# EAGLE design untitled (EAGLE 9.6.2)
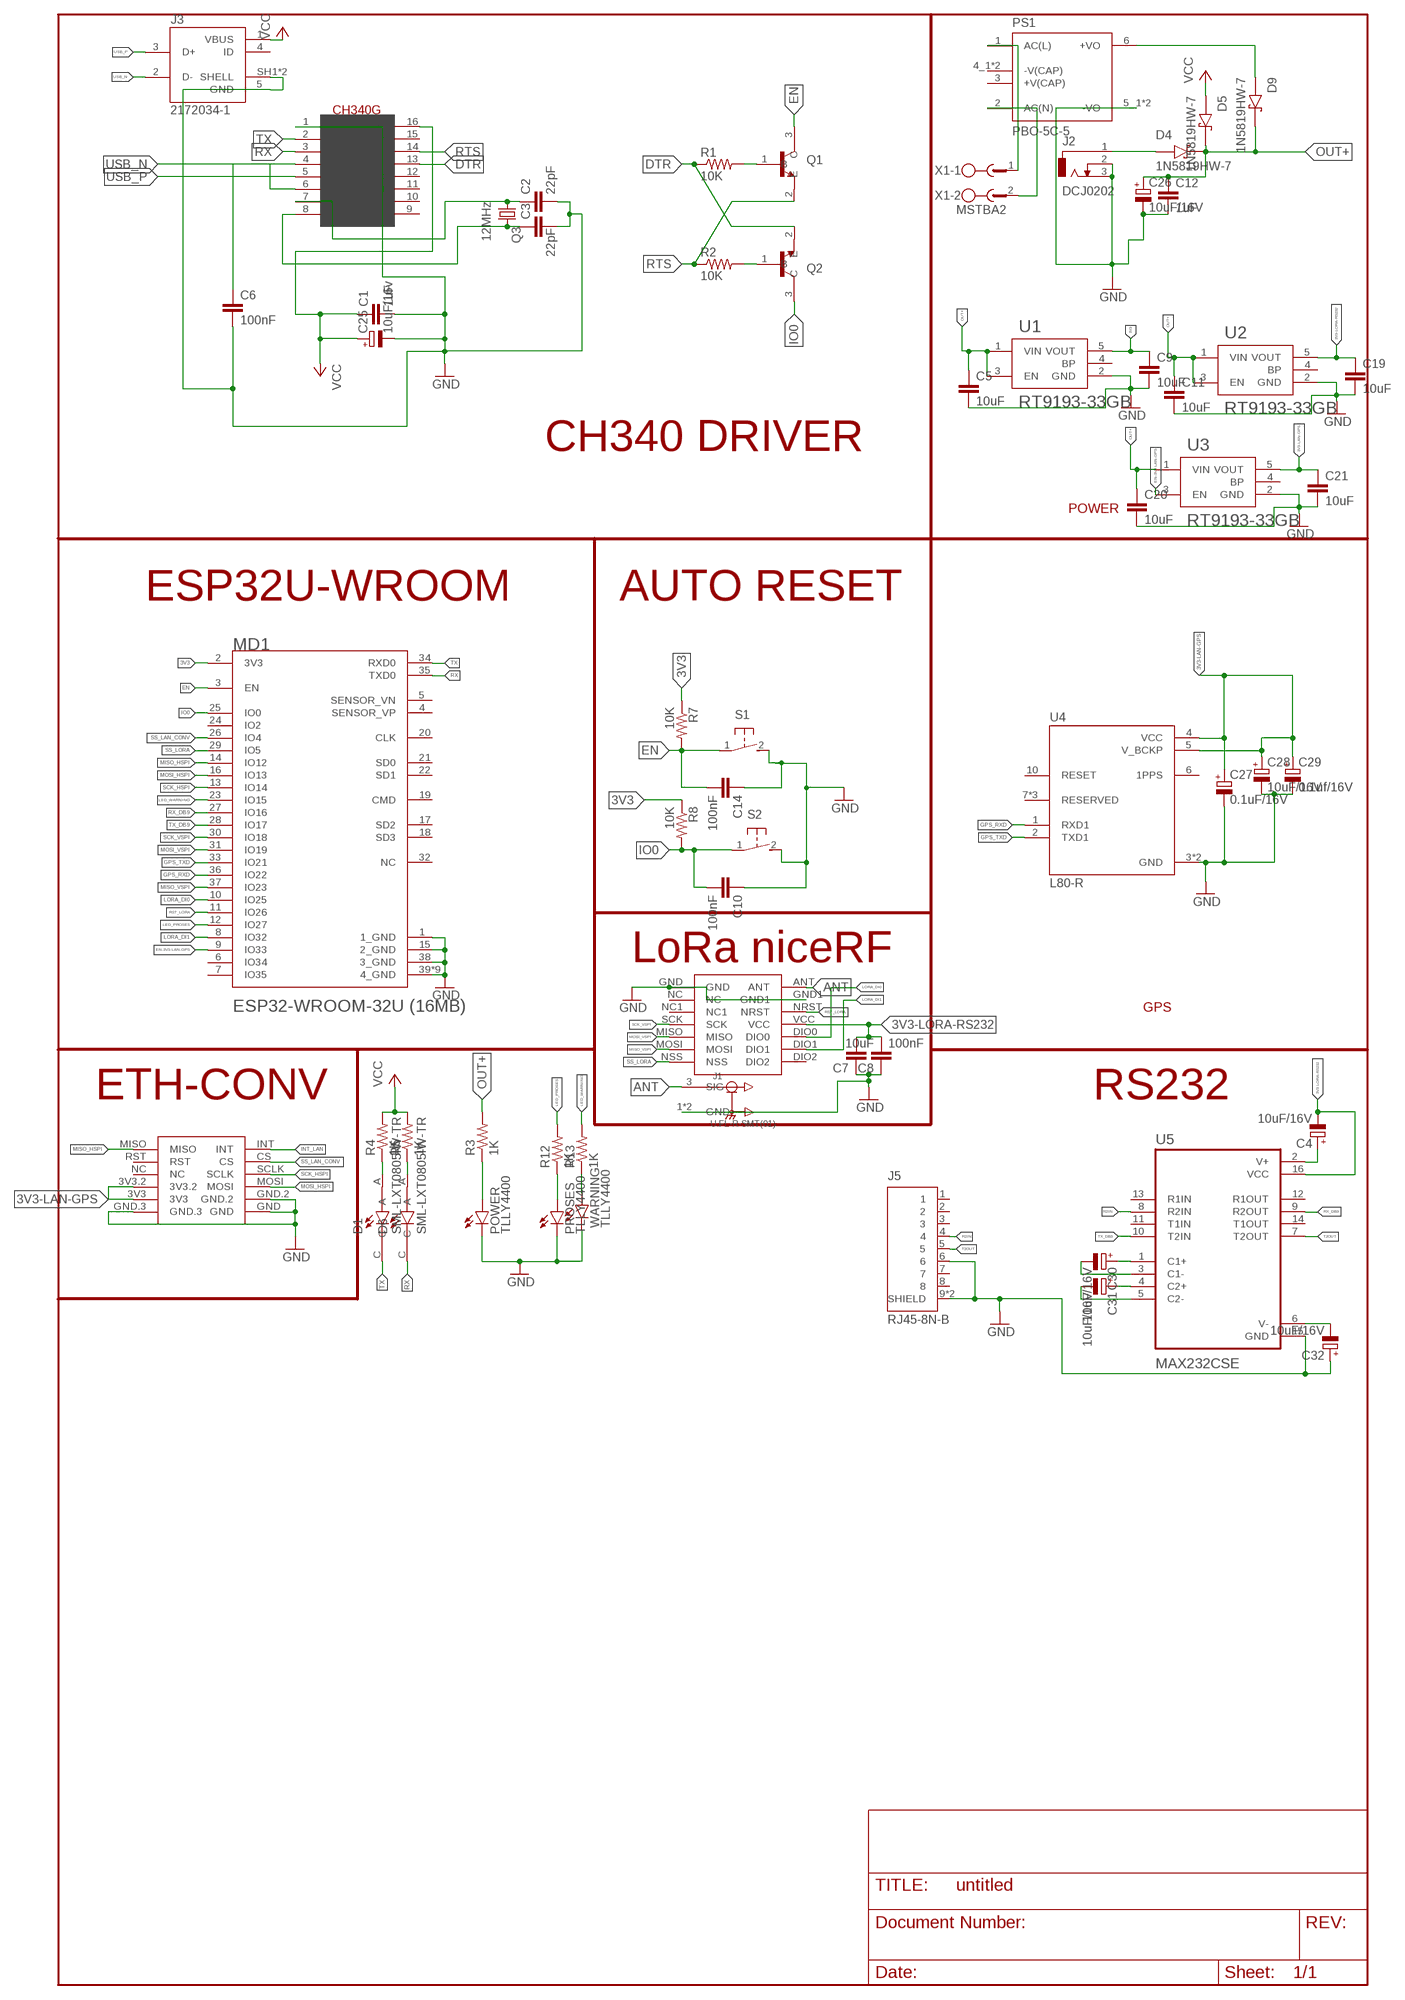
[diagram p0: schematic, sheet 1]

## Parts
C1  1uF  C-EUC0805K  [C0805K]
C2  22pF  C-EUC0805K  [C0805K]
C3  22pF  C-EUC0805K  [C0805K]
C4  10uF/16V  CPOL-EU153CLV-0505  [153CLV-0505]
C5  10uF  C-EUC0805K  [C0805K]
C6  100nF  C-EUC0805K  [C0805K]
C7  10uF  C-EUC0805K  [C0805K]
C8  100nF  C-EUC0805K  [C0805K]
C9  10uF  C-EUC0805K  [C0805K]
C10  100nF  C-EUC0805K  [C0805K]
C11  10uF  C-EUC0805K  [C0805K]
C12  1uF  C-EUC0805K  [C0805K]
C14  100nF  C-EUC0805K  [C0805K]
C19  10uF  C-EUC0805K  [C0805K]
C20  10uF  C-EUC0805K  [C0805K]
C21  10uF  C-EUC0805K  [C0805K]
C25  10uF/16v  CPOL-EU153CLV-0505  [153CLV-0505]
C26  10uF/16V  CPOL-EU153CLV-0505  [153CLV-0505]
C27  0.1uF/16V  CPOL-EU153CLV-0505  [153CLV-0505]
C28  10uF/16V  CPOL-EU153CLV-0505  [153CLV-0505]
C29  0.1uf/16V  CPOL-EU153CLV-0505  [153CLV-0505]
C30  10uF/16V  CPOL-EU153CLV-0505  [153CLV-0505]
C31  10uF/16V  CPOL-EU153CLV-0505  [153CLV-0505]
C32  10uF/16V  CPOL-EU153CLV-0505  [153CLV-0505]
D1  SML-LXT0805IW-TR  [LEDC2012X120N]
D4  1N5819HW-7  [SOD3715X145N]
D5  1N5819HW-7  [SOD3715X145N]
D6  SML-LXT0805IW-TR  [LEDC2012X120N]
D9  1N5819HW-7  [SOD3715X145N]
J1  U.FL-R-SMT(01)  [HRS_U.FL-R-SMT(01)]
J2  DCJ0202  [DCJ0202]
J3  2172034-1  [TE_2172034-1]
J5  RJ45-8N-B  [TE_RJ45-8N-B]
LORA-NICERF-V1  LORA-NICERF-V2  [LORA-NICERF-V2]
MD1  ESPRESSIF_SYSTEMS_ESP32-WROOM-32U_16MBESPRESSIF_SYSTEMS_ESP32-WROOM-32U_16MB_0_0  [ESPRESSIF_SYSTEMS_ESP32-WROOM-32U_16MB_0]
POWER  TLLY4400  [LED3MM]
PROSES  TLLY4400  [LED3MM]
PS1  PBO-5C-5  [CONV_PBO-5C-5]
Q1  MMBT3904  [SOT95P240X120-3N]
Q2  MMBT3904  [SOT95P240X120-3N]
Q3  12MHz  CRYSTALSM49  [SM49]
R1  10K  R-US_M0805  [M0805]
R2  10K  R-US_M0805  [M0805]
R3  1K  R-US_M0805  [M0805]
R4  1K  R-US_M0805  [M0805]
R5  1K  R-US_M0805  [M0805]
R7  10K  R-US_M0805  [M0805]
R8  10K  R-US_M0805  [M0805]
R12  1K  R-US_M0805  [M0805]
R13  1K  R-US_M0805  [M0805]
S1  31-XX  [B3F-31XX]
S2  31-XX  [B3F-31XX]
U1  RT9193-33GB  [SOT94P279X129-5N]
U2  RT9193-33GB  [SOT94P279X129-5N]
U3  RT9193-33GB  [SOT94P279X129-5N]
U4  L80-R  [XCVR_L80-R]
U5  MAX232CSE  [SOIC127P600X175-16N]
U$2  CH340G  [SOIC16]
U$3  MINI_W5500  [MINI_W5500]
WARNING  TLLY4400  [LED3MM]
X1  MSTBA2  [MSTBA2]

## Nets
3V3: C9.1 MD1.2(3V3) R7.1 R8.1 U1.5(VOUT)
3V3-LAN-GPS: C21.1 C27.+ C28.+ C29.+ U3.5(VOUT) U4.4(VCC) U4.5(V_BCKP) U$3.3V3 U$3.3V3.2
3V3-LORA-RS232: C4.- C7.2 C8.2 C19.1 LORA-NICERF-V1.VCC U2.5(VOUT) U5.16(VCC)
ANT: J1.3(SIG) LORA-NICERF-V1.ANT
DTR: Q2.2(E) R1.1 U$2.13(DTR)
EN: C14.2 MD1.3(EN) Q1.3(C) R7.2 S1.1(P)
EN-3V3-LAN-GPS: MD1.9(IO33) U3.3(EN)
GND: C1.2 C2.2 C3.2 C5.2 C6.2 C7.1 C8.1 C9.2 C10.1 C11.2 C12.2 C14.1 C19.2 C20.2 C21.2 C25.- C26.- C27.- C28.- C29.- C32.+ J1.1(GND) J1.2(GND) J2.2 J2.3 J3.5(GND) J3.SH1(SHELL) J3.SH2(SHELL) J5.6 J5.9(SHIELD) J5.10(SHIELD) LORA-NICERF-V1.GND LORA-NICERF-V1.GND1 MD1.1(1_GND) MD1.15(2_GND) MD1.38(3_GND) MD1.39(4_GND) MD1.39-2(4_GND) MD1.39-3(4_GND) MD1.39-4(4_GND) MD1.39-5(4_GND) MD1.39-6(4_GND) MD1.39-7(4_GND) MD1.39-8(4_GND) MD1.39-9(4_GND) POWER.K(C) PROSES.K(C) PS1.5_1(-VO) PS1.5_2(-VO) S1.2(S) S2.2(S) U1.2(GND) U2.2(GND) U3.2(GND) U4.3(GND) U4.12(GND) U5.15(GND) U$2.1(GND) U$3.GND U$3.GND.2 U$3.GND.3 WARNING.K(C)
GPS_RXD: MD1.36(IO22) U4.1(RXD1)
GPS_TXD: MD1.33(IO21) U4.2(TXD1)
INT_LAN: U$3.INT
IO0: C10.2 MD1.25(IO0) Q2.3(C) R8.2 S2.1(P)
LED_PROSES: MD1.12(IO27) R12.2
LED_WARNING: MD1.23(IO15) R13.2
LORA_DI0: LORA-NICERF-V1.DIO0 MD1.10(IO25)
LORA_DI1: LORA-NICERF-V1.DIO1 MD1.8(IO32)
MISO_HSPI: MD1.14(IO12) U$3.MISO
MISO_VSPI: LORA-NICERF-V1.MOSI MD1.37(IO23)
MOSI_HSPI: MD1.16(IO13) U$3.MOSI
MOSI_VSPI: LORA-NICERF-V1.MISO MD1.31(IO19)
N$1: C2.1 Q3.1 U$2.7(XI)
N$2: C3.1 Q3.2 U$2.8(XO)
N$3: POWER.A R3.1
N$4: Q1.1(B) R1.2
N$5: Q2.1(B) R2.2
N$6: D4.A J2.1
N$8: D1.A R4.1
N$9: D6.A R5.1
N$10: C30.+ U5.1(C1+)
N$12: C6.1 U$2.4(V3)
N$13: PS1.1(AC(L)) X1.1
N$14: C30.- U5.3(C1-)
N$15: PS1.2(AC(N)) X1.2
N$16: D9.A PS1.6(+VO)
N$19: C31.+ U5.4(C2+)
N$24: C31.- U5.5(C2-)
N$25: PROSES.A R12.1
N$26: C4.+ U5.2(V+)
N$27: C32.- U5.6(V-)
N$28: R13.1 WARNING.A
OUT+: C5.1 C11.1 C12.1 C20.1 C26.+ D4.C(K) D5.C(K) D9.C(K) R3.2 U1.1(VIN) U1.3(EN) U2.1(VIN) U2.3(EN) U3.1(VIN)
R2IN: J5.4 U5.8(R2IN)
RST_LORA: LORA-NICERF-V1.NRST MD1.11(IO26)
RTS: Q1.2(E) R2.1 U$2.14(RTS)
RX: D6.C MD1.35(TXD0) U$2.3(RX)
RX_DB9: MD1.27(IO16) U5.9(R2OUT)
SCK_HSPI: MD1.13(IO14) U$3.SCLK
SCK_VSPI: LORA-NICERF-V1.SCK MD1.30(IO18)
SS_LAN_CONV: MD1.26(IO4) U$3.CS
SS_LORA: LORA-NICERF-V1.NSS MD1.29(IO5)
T2OUT: J5.5 U5.7(T2OUT)
TX: D1.C MD1.34(RXD0) U$2.2(TX)
TX_DB9: MD1.28(IO17) U5.10(T2IN)
USB_N: J3.2(D-) U$2.6(D-)
USB_P: J3.3(D+) U$2.5(D+)
VCC: C1.1 C25.+ D5.A J3.1(VBUS) R4.2 R5.2 U$2.16(VCC)
Unconnected: J3.4(ID) J5.1 J5.2 J5.3 J5.7 J5.8 LORA-NICERF-V1.DIO2 LORA-NICERF-V1.NC LORA-NICERF-V1.NC1 MD1.4(SENSOR_VP) MD1.5(SENSOR_VN) MD1.6(IO34) MD1.7(IO35) MD1.17(SD2) MD1.18(SD3) MD1.19(CMD) MD1.20(CLK) MD1.21(SD0) MD1.22(SD1) MD1.24(IO2) MD1.32(NC) PS1.3(+V(CAP)) PS1.4_1(-V(CAP)) PS1.4_2(-V(CAP)) U1.4(BP) U2.4(BP) U3.4(BP) U4.6(1PPS) U4.7(RESERVED) U4.8(RESERVED) U4.10(RESET) U4.11(RESERVED) U5.11(T1IN) U5.12(R1OUT) U5.13(R1IN) U5.14(T1OUT) U$2.9(CTS) U$2.10(DSR) U$2.11(RI) U$2.12(DCD) U$2.15(RS232) U$3.NC U$3.RST

## Notes on the sheet
- CH340 DRIVER
- POWER
- ESP32U-WROOM | AUTO RESET
- LoRa niceRF
- GPS
- ETH-CONV | RS232

## Library data of the parts
C1-C3 C5-C12 C14 C19-C21 = rcl:C-EU: CAPACITOR, European symbol; SPICEPREFIX: C
C4 C25-C32 = rcl:CPOL-EU: POLARIZED CAPACITOR, European symbol; SPICEPREFIX: C
D1 D6 = SML-LXT0805IW-TR:SML-LXT0805IW-TR: LED; Luminous Intensity:11µcd; Viewing Angle:140°; Forward Current:30mA; Forward Voltage:2V; Color:Red; LED Color:Red; Leaded Process Compatible:Yes; Lens Color:White; Mounting Type:Surface Mount ;RoHS Compliant: Yes Check availability <https://pricing.snapeda.com/parts/SML-LXT0805IW-TR/Lumex%20Opto/Components/view-part?ref=eda>; AVAILABILITY: In Stock; DESCRIPTION: Red - LED Indication - Discrete 2V 0805 (2012 Metric); MF: Lumex Opto/Components; MP: SML-LXT0805IW-TR; PACKAGE: 0805 Lumex; PRICE: None; PURCHASE-URL: https://pricing.snapeda.com/search/part/SML-LXT0805IW-TR/?ref=eda
D4 D5 D9 = 1N5819HW-7:1N5819HW-7: 1N5819HW Series 40 V 1 A Surface Mount Schottky Barrier Rectifier - SOD-123 Check availability <https://pricing.snapeda.com/parts/1N5819HW-7/Diodes%20Inc./view-part?ref=eda>; AVAILABILITY: In Stock; DESCRIPTION: Diode Schottky 40 V 1A Surface Mount SOD-123; MF: Diodes Inc.; MP: 1N5819HW-7; PACKAGE: SOD-123 Fairchild Semiconductor; PRICE: None; PURCHASE-URL: https://pricing.snapeda.com/search/part/1N5819HW-7/?ref=eda
J1 = U.FL-R-SMT_01_:U.FL-R-SMT(01): U.FL Series 6 Ghz 50 Ohm Ultra-small SMT Coaxial Cable Receptacle Check availability <https://pricing.snapeda.com/parts/U.FL-R-SMT%2801%29/Hirose/view-part?ref=eda>; AVAILABILITY: In Stock; DESCRIPTION: U.FL (UMCC) Connector Receptacle, Male Pin 50Ohm Surface Mount Solder. RF Connectors / Coaxial Connectors; MF: Hirose; MP: U.FL-R-SMT(01); PACKAGE: None; PRICE: None; PURCHASE-URL: https://pricing.snapeda.com/search/part/U.FL-R-SMT(01)/?ref=eda
J2 = con-jack:DCJ0202: DC POWER JACK Source: DCJ0202.pdf; OC_FARNELL: unknown; OC_NEWARK: unknown
J3 = 2172034-1:2172034-1: CONN RCPT USB MINI B 2.0 PCB R/A Check availability <https://pricing.snapeda.com/parts/2172034-1/TE%20Connectivity/view-part?ref=eda>; AVAILABILITY: In Stock; COMMENT: 2172034-1; DESCRIPTION: Conn Mini USB Type B RCP 5 POS 0.8mm Solder RA Thru-Hole 5 Terminal 1 Port Box/Tray; EU_ROHS_COMPLIANCE: Compliant; MF: TE Connectivity; MP: 2172034-1; PACKAGE: None; PRICE: None; PURCHASE-URL: https://pricing.snapeda.com/search/part/2172034-1/?ref=eda
J5 = RJ45-8N-B:RJ45-8N-B: RJ Jack / Signal Line EMI/RFI Filters 6 TERM LOW PROFILE BLOCK INDUCTOR 8 PIN Check availability <https://pricing.snapeda.com/parts/RJ45-8N-B/TE%20Connectivity/view-part?ref=eda>; AVAILABILITY: In Stock; DESCRIPTION: Jack Modular Connector 8p8c (RJ45, Ethernet) 90° Angle (Right) Unshielded -; MF: TE Connectivity; MP: RJ45-8N-B; PACKAGE: None; PRICE: None; PURCHASE-URL: https://pricing.snapeda.com/search/part/RJ45-8N-B/?ref=eda
LORA-NICERF-V1 = LORA-NICERF-V2:LORA-NICERF-V2
MD1 = Espressif Systems - ESP32-WROOM-32U (16MB):ESPRESSIF_SYSTEMS_ESP32-WROOM-32U_16MB: Bluetooth, WiFi 802.11b/g/n, Bluetooth v4.2 +EDR, Class 1, 2 and 3 Transceiver Module 2.4GHz ~ 2.5GHz Antenna Not Included, U.FL Surface Mount; AUTOMOTIVE: No; BANDWIDTH: 72MHz; CENTROID_NOT_SPECIFIED: No; DATASHEET: https://www.espressif.com/sites/default/files/documentation/esp32-wroom-32d_esp32-wroom-32u_datasheet_en.pdf; DATA_RATE: 150Mbits/s; DEVICE_CLASS_L1: Integrated Circuits (ICs); DEVICE_CLASS_L2: RF Semiconductors and Devices; DEVICE_CLASS_L3: Transceivers; DIGIKEY_DESCRIPTION: RX TXRX MODULE WIFI U.FL SMD; DIGIKEY_PART_NUMBER: 1904-1028-1-ND; FOOTPRINT_VARIANT_NAME_0: Recommended_Land_Pattern; HEIGHT: 3.35mm; INTERFACE: I2C,SPI,UART,Ethernet,I2S,Other; LEAD_FREE: Yes; MAX_FREQUENCY: 2484MHz; MAX_SUPPLY_VOLTAGE: 3.6V; MF: Espressif Systems; MFG_PACKAGE_IDENT: 0; MFG_PACKAGE_IDENT_DATE: 0; MFG_PACKAGE_IDENT_REV: 0; MIN_SUPPLY_VOLTAGE: 3V; MOUSER_PART_NUMBER: 356-ES32WROOM32U16MB; MPN: ESP32-WROOM-32U (16MB); NOMINAL_SUPPLY_CURRENT: 0.5A; NUMBER_OF_ADC_CHANNELS: 16; NUMBER_OF_GPIO: 26; PACKAGE: BT_MODULE; PREFIX: MD; ROHS: Yes; SENSITIVITY: -98dBm; TEMPERATURE_RANGE_HIGH: +85°C; TEMPERATURE_RANGE_LOW: -40°C; VERIFICATION_VERSION: 0.0.0.3
POWER PROSES WARNING = led:TLLY4400: Low Current (2mA) LED 3 mm Tinted Diffused Package color YELLOW Source: Data sheet <http://www.farnell.com/datasheets/391098.pdf>; MF: VISHAY SEMICONDUCTOR; OC_FARNELL: 1612439
PS1 = PBO-5C-5:PBO-5C-5: Check availability <https://pricing.snapeda.com/parts/PBO-5C-5/CUI/view-part?ref=eda>; AVAILABILITY: In Stock; CUI_PURCHASE_URL: https://www.cui.com/product/internal-ac-dc-power-supplies/board-mount/pbo-5c-series?utm_source=snapeda.com&utm_medium=referral&utm_campaign=snapedaBOM; DESCRIPTION: 5 W, 85 ~ 305 Vac Input, Single Output, Open Frame, Board Mount, Ac-Dc Power Supply; MF: CUI; MP: PBO-5C-5; PACKAGE: SIP-6 CUI; PRICE: None; PURCHASE-URL: https://pricing.snapeda.com/search/part/PBO-5C-5/?ref=eda
Q1 Q2 = MMBT3904:MMBT3904: MMBT3904 Series 40 V CE Breakdown 0.2 A NPN General Purpose Amplifier - SOT-23 Check availability <https://pricing.snapeda.com/parts/MMBT3904/STMicroelectronics/view-part?ref=eda>; AVAILABILITY: Not in stock; DESCRIPTION: SMD Transistor MMBT3904 SOT-23 SMD DIOTEC; MF: STMicroelectronics; MP: MMBT3904; PACKAGE: SOT-23 ON; PRICE: None
Q3 = adafruit:CRYSTAL: CRYSTAL; OC_FARNELL: unknown; OC_NEWARK: unknown
R1-R5 R7 R8 R12 R13 = adafruit:R-US_: RESISTOR, American symbol
S1 S2 = switch-omron:31-XX: OMRON SWITCH; MPN: B3F-3100; OC_FARNELL: 959704; OC_NEWARK: 36M3582
U1-U3 = RT9193-33GB:RT9193-33GB: RT9193 Series 300 mA 3.3 V Ultra-Low Noise Ultra-Fast CMOS LDO Regulator-SC-70-5 Check availability <https://pricing.snapeda.com/parts/RT9193-33GB/Richtek%20USA%20Inc./view-part?ref=eda>; AVAILABILITY: In Stock; DESCRIPTION: Linear Voltage Regulator IC Positive Fixed 1 Output 300mA SOT-23-5; MF: Richtek USA Inc.; MP: RT9193-33GB; PACKAGE: SOT-23-5 Richtek; PRICE: None; PURCHASE-URL: https://pricing.snapeda.com/search/part/RT9193-33GB/?ref=eda
U4 = L80-R:L80-R: Check availability <https://pricing.snapeda.com/parts/L80-R/Quectel/view-part?ref=eda>; AVAILABILITY: In Stock; DESCRIPTION: L80-R is an ultra compact GPS POT (Patch on Top) module with an embedded 15.0mm × 15.0mm × 4.0mm patch antenna; MF: Quectel; MP: L80-R; PACKAGE: None; PRICE: None
U5 = MAX232CSE:MAX232CSE: Check availability <https://pricing.snapeda.com/parts/MAX232CSE/Maxim%20Integrated/view-part?ref=eda>; AVAILABILITY: In Stock; DESCRIPTION: 2/2 Transceiver Full RS232 16-SOIC; MF: Maxim Integrated; MP: MAX232CSE; PACKAGE: SOIC-16 Maxim Integrated; PRICE: None; PURCHASE-URL: https://pricing.snapeda.com/search/part/MAX232CSE/?ref=eda
U$2 = usb-serial:CH340G
U$3 = ethernet-mikroavr:MINI_W5500: MINI ETHERNET W5500, CREATE BY MIKROAVR.COM
X1 = con-phoenix-508:MSTBA2: PHOENIX; MF: FARNELL; MPN: 1757242; OC_FARNELL: 3705171; OC_NEWARK: 71C4161

## Net classes
0 default: width 0.2 mm, clearance 0.2 mm

## Board
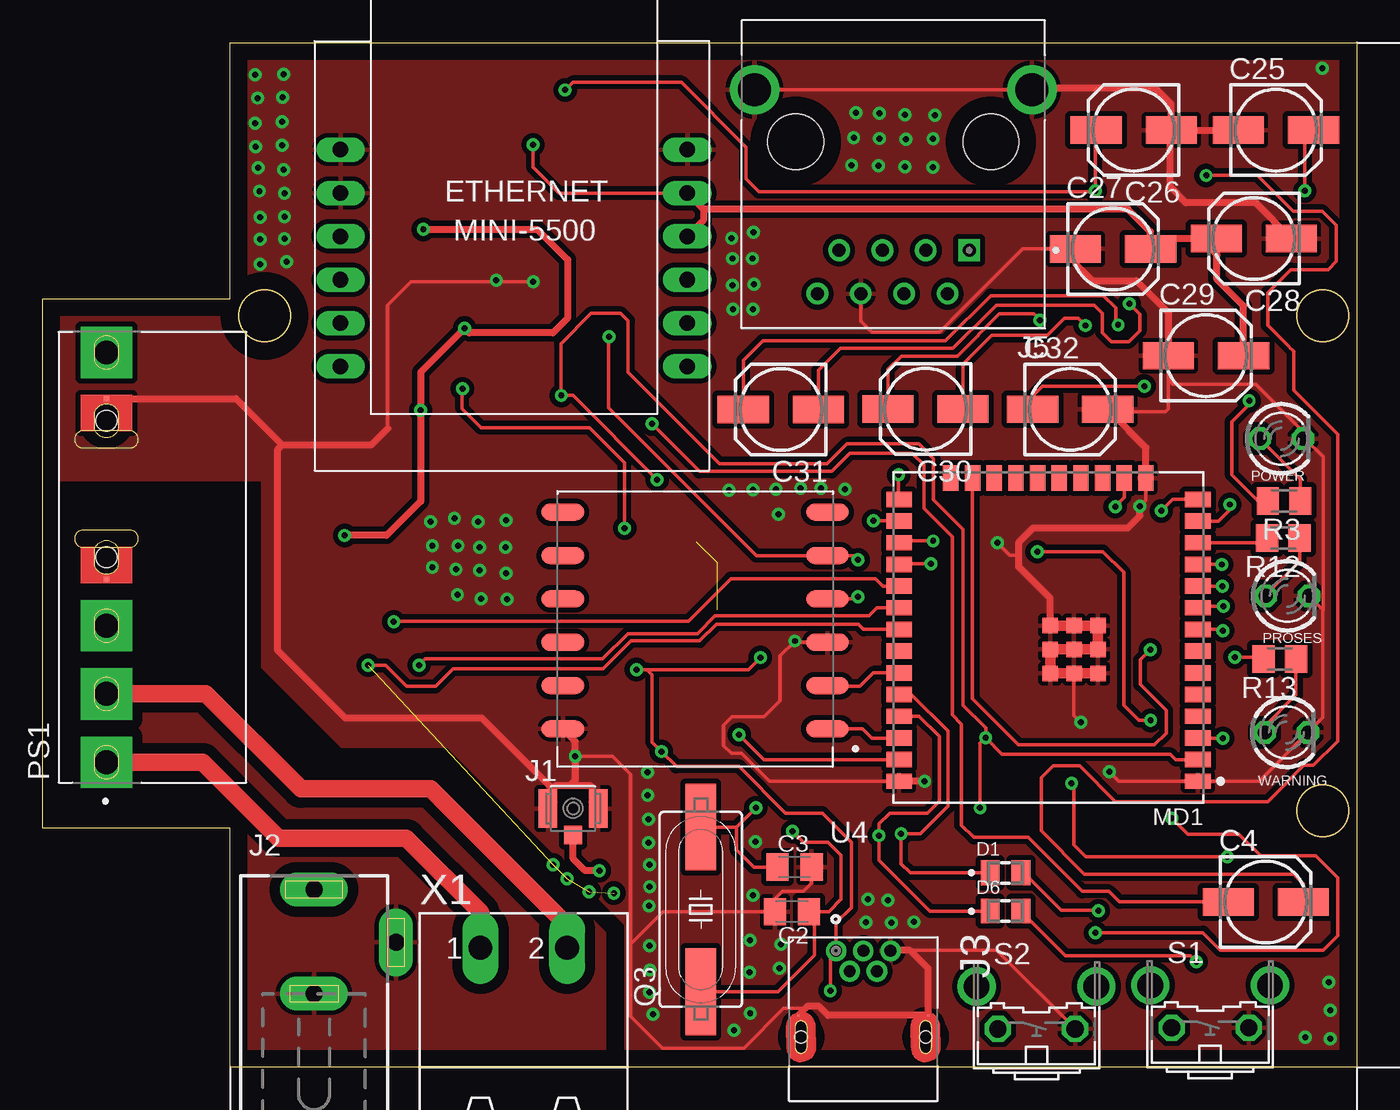
[diagram p1: board, top side]
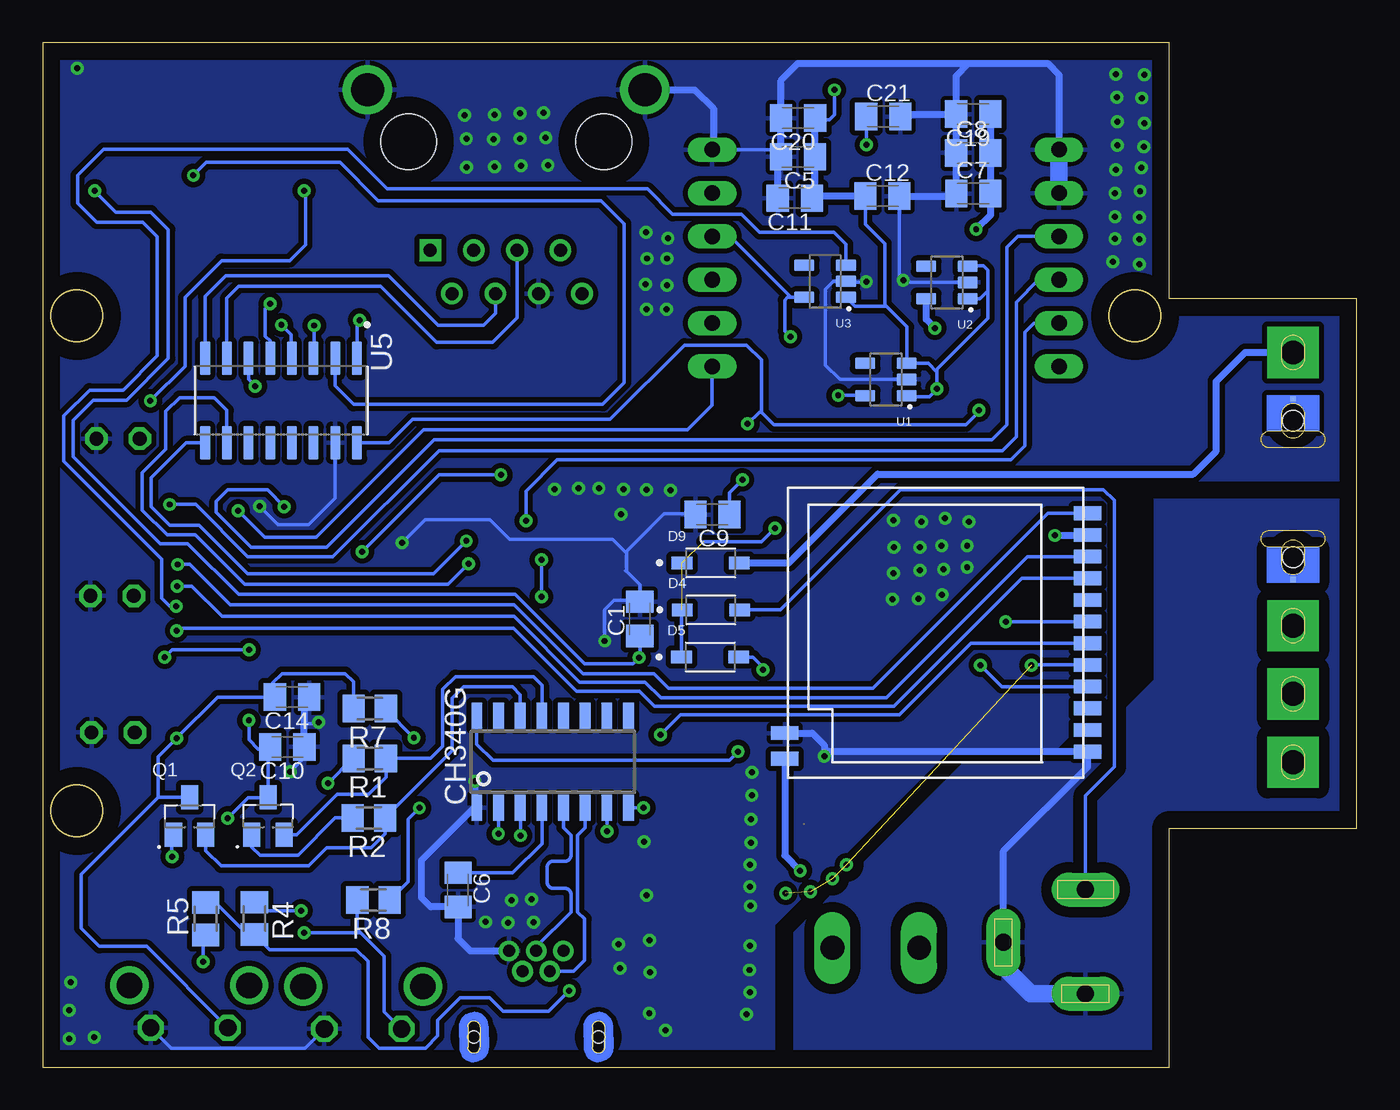
[diagram p2: board, bottom side, seen from below]

Size 77 x 60 mm. Coordinates in mm from the lower left corner, seen from the top.
Outline: 11,60 77,60 77,0 11,0 11,14 0,14 0,45 11,45 11,60
Outline: circle at 75,44 radius 1.5
Outline: circle at 13,44 radius 1.5
Outline: circle at 75,15 radius 1.5
Copper layers (1*16): Top 0.035mm / dielectric 1.5mm / Bottom 0.035mm
Design rules "default": minimum track width 6mil, minimum drill 0.35mm, track to track 6mil, track to pad 6mil, pad to pad 6mil, via to via 6mil, smd to smd 6mil, copper to edge 40mil, drill to drill 6mil, minimum pad ring 10mil, minimum via ring 8mil, stop-mask expansion 4mil, vias tented up to drill 0mil, thermal gap 10mil

### Footprints (pad centres in the part's own frame; a part is rotated, then mirrored left to right if it is on the bottom)
C0805K = smd 1.3 x 1.6: 1 -1,0; 2 1,0
153CLV-0505 = smd 3 x 1.6: + 2.2,0; - -2.2,0
LEDC2012X120N = smd 1.1 x 1.45: A 0.9,0; C -0.9,0
SOD3715X145N = smd 1.21 x 0.73: A 1.68,0; C -1.68,0
HRS_U.FL-R-SMT(01) = smd 1.1 x 2.25: 1 -1.475,0; 2 1.475,0 | smd 1.05 x 1.1: 3 0,-1.55
DCJ0202 = drill 1 pad 2 long: 1 0,3.1; 2 4.8,0; 3 0,-3
TE_2172034-1 = drill 0.7: 1 -5.05,-1.6; 2 -3.85,-0.8; 3 -5.05,0; 4 -3.85,0.8; 5 -5.05,1.6 | smd 0.1 x 0.1: SH1 -1.27,3.81; SH2 -1.27,-3.81 | hole 0.7: 0,3.65; 0,-3.65
TE_RJ45-8N-B = drill 0.76 square: 1 -4.445,6.35 | drill 0.76: 2 -3.175,8.89; 3 -1.905,6.35; 4 -0.635,8.89; 5 0.635,6.35; 6 1.905,8.89; 7 3.175,6.35; 8 4.445,8.89 | drill 1.93: 9 -8.125,-3.05; 10 8.125,-3.05 | hole 3.25: -5.715,0; 5.715,0
LORA-NICERF-V2 = smd 1.6 x 0.8: ANT 9.17,6.81; DIO0 -8.57,-5.03; DIO1 -8.57,-3.76; DIO2 -8.57,-2.49; GND -8.57,6.4; GND1 9.17,5.31; MISO -8.57,1.32; MOSI -8.57,0.05; NC -8.57,5.13; NC1 -8.57,3.86; NRST -8.57,-7.57; NSS -8.57,-1.22; SCK -8.57,2.59; VCC -8.57,-6.3
ESPRESSIF_SYSTEMS_ESP32-WROOM-32U_16MB_0 = smd 1.5 x 0.9: 1 -8.75,8.41; 2 -8.75,7.14; 3 -8.75,5.87; 4 -8.75,4.6; 5 -8.75,3.33; 6 -8.75,2.06; 7 -8.75,0.79; 8 -8.75,-0.48; 9 -8.75,-1.75; 10 -8.75,-3.02; 11 -8.75,-4.29; 12 -8.75,-5.56; 13 -8.75,-6.83; 14 -8.75,-8.1; 25 8.75,-8.1; 26 8.75,-6.83; 27 8.75,-5.56; 28 8.75,-4.29; 29 8.75,-3.02; 30 8.75,-1.75; 31 8.75,-0.48; 32 8.75,0.79; 33 8.75,2.06; 34 8.75,3.33; 35 8.75,4.6; 36 8.75,5.87; 37 8.75,7.14; 38 8.75,8.41 | smd 0.9 x 1.5: 15 -5.71,-9.35; 16 -4.44,-9.35; 17 -3.17,-9.35; 18 -1.9,-9.35; 19 -0.63,-9.35; 20 0.64,-9.35; 21 1.91,-9.35; 22 3.18,-9.35; 23 4.45,-9.35; 24 5.72,-9.35 | smd 0.9 x 0.9: 39 -2.9,2.09; 39-2 -1.5,0.69; 39-3 -1.5,2.09; 39-4 -0.1,2.09; 39-5 -0.1,-0.71; 39-6 -1.5,-0.71; 39-7 -2.9,-0.71; 39-8 -0.1,0.69; 39-9 -2.9,0.69
LED3MM = drill 0.813 octagon: A -1.27,0; K 1.27,0
CONV_PBO-5C-5 = drill 1.4 pad 3 square: 1 -12,0; 2 -8,0; 3 -4,0; 6 12,0 | smd 0.3 x 0.3: 4_1 -1.3,0; 5_1 9.3,0 | smd 0.3 x 0.3 bottom: 4_2 -1.3,0; 5_2 9.3,0 | hole 1.2: 0,0; 8,0
SOT95P240X120-3N = smd 1 x 1.4: 1 -0.95,-1.1; 2 0.95,-1.1; 3 0,1.1
SM49 = smd 5.08 x 1.778: 1 -4.826,0; 2 4.826,0
M0805 = smd 1.3 x 1.6: 1 -0.95,0; 2 0.95,0
B3F-31XX = drill 1.016 octagon: 1 -2.261,-1.245; 2 2.261,-1.245 | drill 1.499 pad 2.159: 3 -3.505,1.245; 4 3.505,1.245
SOT94P279X129-5N = smd 1.17 x 0.67: 1 -1.22,0.94; 2 -1.22,0; 3 -1.22,-0.94; 4 1.22,-0.94; 5 1.22,0.94
XCVR_L80-R = smd 2.5 x 1: 1 -7.75,6.35; 2 -7.75,3.81; 3 -7.75,1.27; 4 -7.75,-1.27; 5 -7.75,-3.81; 6 -7.75,-6.35; 7 7.75,-6.35; 8 7.75,-3.81; 9 7.75,-1.27; 10 7.75,1.27; 11 7.75,3.81; 12 7.75,6.35
SOIC127P600X175-16N = smd 1.97 x 0.59: 1 -2.475,4.445; 2 -2.475,3.175; 3 -2.475,1.905; 4 -2.475,0.635; 5 -2.475,-0.635; 6 -2.475,-1.905; 7 -2.475,-3.175; 8 -2.475,-4.445; 9 2.475,-4.445; 10 2.475,-3.175; 11 2.475,-1.905; 12 2.475,-0.635; 13 2.475,0.635; 14 2.475,1.905; 15 2.475,3.175; 16 2.475,4.445
SOIC16 = smd 0.635 x 1.524: 1 -4.445,-2.695; 2 -3.175,-2.695; 3 -1.905,-2.695; 4 -0.635,-2.695; 5 0.635,-2.695; 6 1.905,-2.695; 7 3.175,-2.695; 8 4.445,-2.695; 9 4.445,2.695; 10 3.175,2.695; 11 1.905,2.695; 12 0.635,2.695; 13 -0.635,2.695; 14 -1.905,2.695; 15 -3.175,2.695; 16 -4.445,2.695
MINI_W5500 = drill 0.914 long: 3V3 21.844,-8.89; 3V3.2 21.844,-11.43; CS 1.524,-16.51; GND 1.524,-6.35; GND.2 1.524,-8.89; GND.3 21.844,-6.35; INT 1.524,-19.05; MISO 21.844,-19.05; MOSI 1.524,-11.43; NC 21.844,-13.97; RST 21.844,-16.51; SCLK 1.524,-13.97
MSTBA2 = drill 1.397 long: 1 -2.54,5.08; 2 2.54,5.08

### Placement (x,y rotation side)
C1  42.01,26.25 90 bottom
C2  43.9,9.1 180 top
C3  44.06,11.71 0 top
C4  71.66,9.67 0 top
C5  32.75,53.32 180 bottom
C6  52.66,10.38 270 bottom
C7  22.46,51.16 0 bottom
C8  22.47,53.55 0 bottom
C9  37.76,32.36 180 bottom
C10  62.67,18.75 180 bottom
C11  32.93,50.89 180 bottom
C12  27.79,51.01 0 bottom
C14  62.39,21.67 180 bottom
C19  22.47,55.81 180 bottom
C20  32.74,55.59 180 bottom
C21  27.75,55.68 0 bottom
C25  72.26,54.88 0 top
C26  63.93,54.88 180 top
C27  62.71,47.92 0 top
C28  70.97,48.53 180 top
C29  68.16,41.67 0 top
C30  51.73,38.54 180 top
C31  43.25,38.52 180 top
C32  60.2,38.52 0 top
D1  56.41,11.38 0 top
D4  37.85,26.78 0 bottom
D5  37.89,24.02 0 bottom
D6  56.42,9.14 0 top
D9  37.86,29.53 0 bottom
J1  31.08,15.14 0 top
J2  15.9,7.3 0 top
J3  48.08,1.76 270 top
J5  49.84,54.19 180 top
LORA-NICERF-V1  24.34,24.87 180 bottom
MD1  58.93,25.15 180 top
POWER  72.58,36.81 0 top
PROSES  72.93,27.6 0 top
PS1  3.74,29.86 90 top
Q1  68.39,14.7 0 bottom
Q2  63.8,14.7 0 bottom
Q3  38.56,9.23 90 top
R1  57.84,18.08 180 bottom
R2  57.88,14.59 180 bottom
R3  72.73,33.16 180 top
R4  64.59,8.71 270 bottom
R5  67.45,8.69 90 bottom
R7  57.84,20.99 180 bottom
R8  57.62,9.79 180 bottom
R12  72.69,30.98 180 top
R13  72.49,23.89 180 top
S1  68.41,3.55 0 top
S2  58.23,3.48 0 top
U1  27.59,40.27 180 bottom
U2  24.01,45.95 180 bottom
U3  31.15,46.02 180 bottom
U4  38.23,26.15 180 top
U5  63.03,39.04 270 bottom
U$2  47.12,17.88 0 bottom
U$3  15.93,60.08 0 top
WARNING  72.87,19.6 0 top
X1  28.18,1.9 0 top

### Tracks (layer width: path | path; a pad name or v marks a point on that pad's centre or on a via)
3V3  (via drill 0.35)
  Top 0.2: v36.01,34.4 31.07,39.34 v30.39,39.34 30.37,39.36 30.37,42.37 32.14,44.14 33.86,44.14 34.3,43.7 34.3,40.69 39.65,35.34 45.97,35.34 47.13,36.5 51.33,36.5 52.2,35.64 52.2,33.24 53.92,31.51 53.92,21.19 55.25,19.86 v55.25,19.28 | MD1.2 66.39,18.01 66.08,18.32 56.22,18.32 v55.25,19.28 | v55.25,19.28 54.93,18.96 v54.93,15.18
  Bottom 0.2: 36.6,32.52 C9.1 36.76,33.65 v36.01,34.4 | v30.39,39.34 U1.5 | R7.1 56.89,20.92 v55.25,19.28 | R8.1 55.59,10.86 55.59,14.51 v54.93,15.18
3V3-LAN-GPS  (via drill 0.35)
  Top 0.2: U$3.3V3 30.24,51.19 28.74,52.7 v28.74,54.02 | v33.19,42.79 33.15,42.75 33.15,38.63 41.82,29.96 U4.5 47.52,29.96 v47.78,29.71 | U4.4 47.66,27.42 v47.78,27.55
  Top 0.406: C29.+ 70.36,44.58 68.81,46.13 68.81,47.57 68.77,47.61 | 38.71,50.25 63.6,50.25 64.91,48.94 C27.+ 65.52,48.53 C28.+ 68.77,47.61 | 38.71,50.25 U$3.3V3 | 38.71,50.25 38.71,49.59 U$3.3V3.2 | 68.77,47.61 68.46,47.92
  Bottom 0.2: U$3.3V3.2 36.72,48.65 33.15,45.08 U3.5 33.35,45.08 33.51,44.92 33.51,43.11 v33.19,42.79 | v28.74,54.02 28.74,55.67 C21.1 | v47.78,27.55 v47.78,29.71
3V3-LORA-RS232  (via drill 0.35)
  Top 0.2: C4.- 63.09,9.67 62.47,10.3 60.91,10.3 57.76,13.45 54.55,13.45 53.83,14.17 53.83,20.09 53.29,20.63 53.29,31.05 51.62,32.72 51.62,35.27 50.94,35.95 47.3,35.95 46.23,34.89 38.48,34.89 v35.69,37.67
  Top 0.406: v22.31,49.07 28.98,49.07 30.76,47.29 30.76,43.87 29.89,43.01 24.99,43.01 v24.72,43.28 22.15,40.71 v22.15,38.47 22.15,33.14 20.15,31.14 v17.7,31.14
  Bottom 0.2: U5.16 56.69,36.57 55.33,37.93 43.74,37.93 39.38,42.29 35.76,42.29 34.89,41.42 34.89,38.36 | 34.89,38.36 34.15,37.62 22.92,37.62 22.07,38.47 v22.15,38.47 | v35.69,37.67 35.01,38.36 34.89,38.36
  Bottom 0.406: C19.1 | C19.1 C8.2 C7.2 21.46,49.91 v22.31,49.07 | v24.72,43.28 25.23,43.79 U2.5 | v17.7,31.14 15.81,31.14 LORA-NICERF-V1.VCC
ANT  (via drill 0.35)
  Top 0.406: v32.62,11.51 31.79,11.51 31.08,12.22 J1.3
  Bottom 0.406: LORA-NICERF-V1.ANT 33.51,12.4 v32.62,11.51
DTR
  Bottom 0.2: Q2.2 62.11,13.6 59.74,15.97 57.9,15.97 56.89,16.98 R1.1 54.26,18.08 53.55,18.79 53.55,22.14 52.82,22.87 48.24,22.87 47.74,22.37 U$2.13
EN  (via drill 0.35)
  Top 0.2: v69.15,19.26 67.7,19.26 MD1.3
  Bottom 0.2: S1.1 70.92,7.07 73.69,7.07 74.75,8.14 74.75,11.29 70.23,15.81 | 70.23,15.81 Q1.3 | R7.2 58.79,22.56 59.27,23.05 62.98,23.05 63.52,22.51 63.52,21.67 | 70.23,15.81 70.23,18.18 v69.15,19.26 69.15,19.27 66.75,21.67 63.52,21.67 | 63.41,21.66 C14.2 63.52,21.67
EN-3V3-LAN-GPS  (via drill 0.35)
  Top 0.2: MD1.9 67.76,26.98 v69.18,26.98
  Bottom 0.2: v69.18,26.98 69.56,26.98 70.03,27.45 70.03,29.76 75.76,35.49 75.76,38.15 74.26,39.65 72.3,39.65 70.29,41.66 70.29,48.65 71.12,49.49 73.84,49.49 74.95,50.59 74.95,52.22 73.43,53.75 59.14,53.75 56.83,51.44 41.57,51.44 40.09,49.95 36.05,49.95 34.99,48.89 30.63,48.89 29.93,48.2 U3.3
GND  (via drill 0.35)  (1 unrouted)
  Top 0.2: WARNING.K 74.8,20.26 | WARNING.K 71.28,16.74 MD1.1 63.06,16.74 v62.5,17.3 | C3.2 45.06,10.78 44.59,10.31 43.34,10.31 42.9,9.87 C2.2 36.36,9.1 34.45,7.19 | C29.- 65.96,41.64 65.96,40.27 | 73.23,48.46 C28.- | v64.29,32.85 64.64,33.2 MD1.15 | C27.- 57.43,47.92 52.55,43.04 48.58,43.04 47.94,43.68 J5.6 | v28.75,45.99 26.58,45.99 | 26.58,45.99 v26.58,46.09 | v60.84,20.19 60.43,20.59 MD1.39-3 | 20.22,37.25 20.22,37.4 20.22,44.61 21.6,45.99 26.58,45.99 | 44.68,3.44 43.41,3.44 41.09,1.12 36.31,1.12 34.45,2.98 34.45,7.19 | 34.45,7.19 34.42,7.16 | 34.45,7.19 34.45,17.15 33.38,18.22 v31.21,18.22 | MD1.38 42.58,16.74 40.94,18.38 40.35,18.38 39.9,18.83 39.9,20.03 40.4,20.53 42.27,20.53 43.19,21.45 43.19,24.08 v44.06,24.96 44.14,24.88 U4.3 45.98,24.76 45.44,24.76 | S2.2 55.89,6.83 50.82,6.83 | 65.96,40.27 66.23,39.99 71.07,39.99 73.85,37.22 POWER.K 73.88,36.83 73.93,36.83 75.03,35.73 75.03,26.77 75.02,26.78 | 65.96,40.27 65.96,38.56 65.77,38.37 62.56,38.37 62.55,38.38 | v55.95,30.7 56.68,29.98 57.2,29.98 | PROSES.K 75.02,26.78 | WARNING.K 75.02,20.48 75.02,26.78 | J5.10 J5.9
  Top 0.406: 30.41,19.87 U4.12 31.21,19.07 v31.21,18.22 31.21,16.79 30.91,16.5 | MD1.15 64.64,36.29 62.55,38.38 C32.+ | C26.- C25.- 70.03,54.84 | 73.17,49.1 C28.- 71.08,50.61 66.99,50.61 66.06,51.55 66.06,54.81 C26.- | C27.- 60.51,47.04 61.5,46.06 64.07,46.06 65.96,44.17 65.96,41.64 | C26.- 66.13,56.4 65.19,57.33 58.06,57.33 J5.9 | v51.68,16.73 MD1.38 | J3.SH1 | J3.SH1 51.9,5.76 50.82,6.83 49.71,6.83 J3.5 | J3.SH1 46.02,3.03 45.49,3.56 44.8,3.56 44.68,3.44 J3.SH2 44.43,3.18 | MD1.39-5 59.03,27.46 57.2,29.29 57.2,29.98 57.2,30.74 58.04,31.58 63.58,31.58 64.29,32.3 v64.29,32.85 | PS1.5_2 11.33,39.16 14.03,36.45 | 14.03,36.45 19.28,36.45 20.22,37.4 | 29.97,16.38 30.09,16.5 30.91,16.5 | 30.91,16.5 32.06,16.5 32.18,16.38 32.18,15.52 J1.2 | J1.1 29.97,15.51 29.97,16.38 | 29.97,16.38 29.8,16.38 25.74,20.44 17.74,20.44 13.77,24.41 13.77,36.19 14.03,36.45
  Top 0.61: MD1.39-5 MD1.39-6 MD1.39-7 MD1.39-9 MD1.39-2 MD1.39-8 MD1.39-4 MD1.39-3 MD1.39
  Bottom 0.2: S2.2 61.61,1.12 69.48,1.12 S1.2 | 22.82,45.98 U2.2 26.44,45.95 v26.58,46.09 26.79,46.31 C12.2 | U5.15 59.86,33.32 61.41,31.77 63.21,31.77 v64.29,32.85 | U$3.GND.3 37.7,53.73 34.17,53.73 C5.2 | U1.2 30.3,40.27 31.13,41.1 31.13,45.57 30.68,46.02 U3.2 29.87,45.96 28.77,45.96 v28.75,45.99 | 42.8,29.04 42.8,30.09 | 42.8,30.09 42.8,30.2 40.6,32.41 38.8,32.41 C9.2 | 42.84,29.08 42.8,29.04 | 42.8,29.04 42.01,28.25 C1.2 42.1,27.34 43.51,27.34 44.06,26.79 v44.06,24.96 | 61.67,20.11 60.91,20.11 v60.84,20.19 | v62.5,17.3 61.67,18.13 C10.1 | 42.8,30.09 43.61,30.9 49.65,30.9 50.8,32.05 54.6,32.05 v55.95,30.7
  Bottom 0.406: J3.5 51.95,6.81 52.66,7.52 C6.2 54.26,9.38 54.8,9.92 54.8,12.1 51.72,15.19 U$2.1 51.68,15.3 v51.68,16.73 | LORA-NICERF-V1.GND1 31.91,19.56 31.21,18.86 v31.21,18.22 30.95,18.47 LORA-NICERF-V1.GND 15.77,17.59 20.7,12.66 J2.2 | C11.2 33.93,53.14 C5.2 33.75,55.58 C20.2 33.74,57.8 32.75,58.78 22.75,58.78 | C19.2 C8.1 C7.1 23.61,51.01 C12.2 | C19.2 | C19.2 23.47,58.06 22.75,58.78 | 22.75,58.78 18.11,58.78 17.45,58.12 U$3.GND | C21.2 26.61,55.81 C19.2 | C10.1 61.67,20.11 61.67,21.4 C14.1 | J5.10 38.8,57.24 37.7,56.15 37.7,53.73
  Bottom 1.016: U$3.GND.2 U$3.GND | J2.2 20.7,5.9 19.1,4.3 J2.3
  other vias: 35.43,17.26 35.45,15.92 35.5,14.52 35.49,13.13 35.55,11.85 35.57,10.57 35.52,9.44 35.55,7.1 35.59,5.69 35.55,4.38 35.76,3.09 41.46,3.16 40.51,2.16 41.41,5.55 41.45,7.44 41.61,10.06 41.76,13.2 12.45,58.12 14.13,58.15 14.06,56.79 14.03,55.36 14.03,54 14.13,52.57 14.16,51.17 14.16,49.81 14.16,48.52 14.3,47.16 12.59,56.76 12.45,55.29 12.49,53.9 12.63,52.67 12.7,51.31 12.73,49.78 12.73,48.48 12.73,47.02 48.23,8.48 49.74,8.45 51.04,8.5 48.35,9.83 49.52,9.76 43.16,5.79 43.25,7.2 27.15,32.03 27.12,30.46 27.15,28.92 27.21,27.4 25.69,27.43 25.61,29.09 25.61,30.46 25.52,31.94 24.33,30.55 24.21,29.15 24.3,27.67 24.12,32.15 40.21,33.79 41.63,33.81 42.96,33.83 44.41,33.9 45.61,33.9 47.01,33.85 22.73,31.94 22.83,30.54 22.83,29.28 41.65,48.9 41.59,47.36 41.68,45.85 41.62,44.39 40.46,44.39 40.43,45.79 40.43,47.36 40.37,48.55 74.96,58.5 47.4,52.81 48.98,52.79 50.53,52.74 52.15,52.71 52.18,54.36 50.58,54.34 49.02,54.39 47.52,54.43 47.64,55.89 49.02,55.86 50.53,55.77 52.27,55.74 43.12,32.39 75.45,1.65 75.45,3.33 75.36,4.97 73.98,1.74
  pour Top (isolate 0.305): 0,34.3 12.8,34.3 12.8,23.4 17.5,18.7 23.7,18.7 34.1,8.3 34.1,0 77,0 77,60 11,60 11,45 0,45
  pour Top (isolate 0.61): 0,14 11,14 11,0 33,0 33,7.9 23,17.9 16.7,17.9 11.9,22.7 11.9,33.3 0,33.3
  pour Bottom (isolate 0.61): 0,33.3 0,14 11,14 11,0 33,0 33,7.9 23,17.9 16.7,17.9 11.9,22.7 11.9,33.3
  pour Bottom (isolate 0.305): 0,34.3 12.8,34.3 12.8,23.4 17.5,18.7 23.7,18.7 34.1,8.3 34.1,0 77,0 77,60 11,60 11,45 0,45
GPS_RXD
  Top 0.2: U4.1 48.05,19.8 48.6,19.25 50.15,19.25 MD1.36
GPS_TXD
  Top 0.2: MD1.33 48.68,23.09 47.89,22.29 46.03,22.29 U4.2
IO0  (via drill 0.35)
  Top 0.2: v64.92,20.3 64.21,20.3 63.34,21.18 63.34,28.98 62.13,30.19 v58.27,30.19 | v61.69,7.87 67.98,7.87 69,6.86 75.04,6.86 75.88,7.7 75.88,11.08 74.6,12.36 71.37,12.36 70.09,13.65 67.09,13.65 66.61,14.12 v66.15,14.59 | v50.15,34.68 50.15,33.28 MD1.25
  Bottom 0.2: S2.1 56.99,3.25 56.99,6.5 58.36,7.87 | 63.8,18.62 Q2.3 63.82,15.78 64.95,15.78 v66.15,14.59 | 63.8,18.62 C10.2 | v64.92,20.3 64.92,19.17 64.36,18.62 63.8,18.62 | v61.69,7.87 58.36,7.87 | R8.2 58.57,8.08 58.36,7.87 | v58.27,30.19 53.78,34.68 v50.15,34.68
LED_PROSES
  Top 0.2: MD1.12 71.47,30.71 R12.2
LED_WARNING  (via drill 0.35)
  Top 0.2: MD1.23 54.48,21.58 57.18,18.88 65.15,18.88 65.83,19.57 65.83,20.89 64.31,22.41 64.31,23.85 v64.9,24.44 | R13.2 71.42,24.01 v69.85,24.01
  Bottom 0.2: v64.9,24.44 69.42,24.44 v69.85,24.01
LORA_DI0  (via drill 0.35)
  Top 0.2: 67.65,28.14 MD1.10 v69.12,28.17
  Bottom 0.2: LORA-NICERF-V1.DIO0 19.29,29.9 27.57,21.62 40.77,21.62 41.7,22.54 45.53,22.54 49.38,26.39 66.5,26.39 68.27,28.17 v69.12,28.17
LORA_DI1  (via drill 0.35)
  Top 0.2: MD1.8 69.09,25.63 v69.15,25.56
  Bottom 0.2: LORA-NICERF-V1.DIO1 19.61,28.63 27.12,21.13 41.15,21.13 42.04,22.01 45.73,22.01 49.41,25.7 69.02,25.7 v69.15,25.56
MISO_HSPI  (via drill 0.35)
  Top 0.2: v65.54,32.58 66.22,33.25 MD1.14
  Bottom 0.2: U$3.MISO 37.77,38.77 39.2,37.34 54.67,37.34 60.98,31.03 64,31.03 v65.54,32.58
MISO_VSPI  (via drill 0.35)
  Top 0.2: MD1.37 42.27,18.01 v40.81,19.48
  Bottom 0.2: LORA-NICERF-V1.MOSI 22.62,24.82 26.79,20.65 39.63,20.65 v40.81,19.48
MOSI_HSPI  (via drill 0.35)
  Top 0.2: MD1.16 63.37,33.37 62.84,32.84 v62.84,32.82
  Bottom 0.2: v62.84,32.82 63.83,33.81 66.15,33.81 66.82,33.13 66.82,32.49 64.78,30.45 60.35,30.45 54.08,36.73 21.39,36.73 20.49,37.63 20.49,48.02 19.86,48.65 U$3.MOSI
MOSI_VSPI  (via drill 0.35)  (4 unrouted)
  Top 0.2: v19.07,23.53 20.1,23.53 21.34,22.3 23.01,22.3 24.04,23.32 32.84,23.32 34.48,24.96 38.49,24.96 39.47,25.94 47.79,25.94 48.1,25.63 MD1.31
  Bottom 0.2: LORA-NICERF-V1.MISO 19.05,23.55 v19.07,23.53
  other vias: 33.46,10.19 32.02,10.27 30.74,11.04 29.91,11.85
N$1  (via drill 0.35)
  Top 0.2: Q3.1 43.08,4.41 45.22,6.54 45.22,8.79 C2.1 46.06,9.1 46.78,9.82 46.78,12.42 46.02,13.18 44.57,13.18 v43.95,13.8
  Bottom 0.2: v43.95,13.8 v43.94,13.81 U$2.7
N$2  (via drill 0.35)
  Top 0.2: Q3.2 40.65,14.06 | 40.65,14.06 v41.78,15.19 | C3.1 41.66,11.71 40.65,12.72 40.65,14.06
  Bottom 0.2: v41.78,15.19 U$2.8
N$3
  Top 0.2: R3.1 73.68,34.44 POWER.A
N$4  (via drill 0.35)
  Top 0.2: v69.4,12.32 61.13,12.32 60.42,13.03 60.42,16.5 v60.29,16.63
  Bottom 0.2: Q1.1 69.43,13.51 69.43,12.32 v69.4,12.32 | v60.29,16.63 58.84,18.08 R1.2
N$5
  Bottom 0.2: Q2.1 64.75,12.88 64.27,12.4 62.04,12.4 59.85,14.59 R2.2
N$6
  Bottom 0.2: D4.A 35,26.78 34.99,26.78 33.78,26.78 26.74,33.83 14.86,33.83 14.22,33.19 14.22,17.58 15.9,15.9 J2.1
N$8  (via drill 0.35)
  Top 0.2: D1.A 57.5,11.38 59.7,9.18 61.83,9.18 v61.86,9.16
  Bottom 0.2: R4.1 64.08,9.16 v61.86,9.16
N$9  (via drill 0.35)
  Top 0.2: D6.A 59.93,6.52 67.23,6.52 v67.59,6.16
  Bottom 0.2: R5.1 67.59,7.6 v67.59,6.16
N$10  (via drill 0.35)
  Top 0.2: C30.+ 49.53,40.86 50.3,41.64 53.59,41.64 56.07,44.12 58.06,44.12 v58.43,43.75
  Bottom 0.2: v58.43,43.75 58.59,43.6 U5.1
N$12
  Bottom 0.2: C6.1 49.46,11.38 47.75,13.09 U$2.4
N$13
  Top 1.016: X1.1 25.64,9.07 21.3,13.41 13.82,13.41 9.38,17.85 PS1.1
N$14  (via drill 0.35)
  Top 0.2: C30.- 53.93,41.16 55.62,42.85 58.88,42.85 59.88,43.85 60.68,43.85 v61.09,43.44
  Bottom 0.2: v61.09,43.44 61.09,41.56 U5.3
N$15
  Top 1.016: X1.2 30.73,8.31 22.74,16.3 15.13,16.3 9.55,21.88 3.76,21.88 PS1.2
N$16
  Bottom 0.406: D9.A 33.28,29.53 28.07,34.74 9.59,34.74 8.24,36.08 8.24,40.16 6.55,41.86 PS1.6
N$19  (via drill 0.35)
  Top 0.2: C31.+ 41.05,41.39 42.2,42.54 52.9,42.54 55.55,45.18 62.16,45.18 62.88,44.46 62.88,43.6 v63.01,43.47
  Bottom 0.2: v63.01,43.47 62.43,42.89 62.43,41.55 U5.4
N$24  (via drill 0.35)
  Top 0.2: C31.- 45.45,40.8 46.74,42.09 53.33,42.09 55.87,44.63 61.62,44.63 62.09,44.17 62.09,43.01 62.61,42.49 63.64,42.49 64.28,43.12 64.28,44.09 v63.67,44.7
  Bottom 0.2: v63.67,44.7 63.96,44.41 63.96,42.82 63.67,42.53 U5.5
N$25
  Top 0.2: PROSES.A 71.66,27.65 73.64,29.64 R12.1
N$26  (via drill 0.35)
  Top 0.2: C4.+ 73.86,10.74 73.3,11.3 61.04,11.3 58.5,13.83 58.5,16.94 59.21,17.65 60.77,17.65 62.86,15.55 71.78,15.55 73.89,17.67 74.46,17.67 75.88,19.09 75.88,37.06 73.3,39.64 73.3,41.94 73.23,42 73.11,42.11 73,42.23 71.78,43.46 71.78,45.35 73.14,46.71 75.32,46.71 75.81,47.2 75.81,49.29 74.99,50.11 73.28,50.11 71.17,52.22 v68.17,52.22
  Bottom 0.2: v68.17,52.22 67.41,52.98 59.58,52.98 57.35,50.75 44.27,50.75 42.93,49.41 42.93,40.08 44.19,38.82 58.79,38.82 59.86,39.89 U5.2
N$27  (via drill 0.35)
  Top 0.2: C32.- 58,39.31 58.59,39.89 v64.54,39.89
  Bottom 0.2: v64.54,39.89 64.94,40.28 U5.6
N$28
  Top 0.2: R13.1 73.44,21.8 71.57,19.94 71.57,19.63 WARNING.A
OUT+  (via drill 0.35)  (2 unrouted)
  Top 0.2: v34.1,31.57 34.1,35.39 32.04,37.45 25.68,37.45 24.58,38.56 24.58,39.76 24.6,39.75 v24.6,39.73 | R3.2 71.2,33.16 69.66,34.7 69.66,37.8 70.69,38.83 v70.69,39.02 | C26.+ 61.68,54.83 v61.68,51.34 61.62,51.28 60.31,51.28 41.96,51.28 41.22,52.02 41.22,53.87 37.42,57.67 31.06,57.67 v30.62,57.23
  Bottom 0.2: D4.C 39.57,26.74 D5.C | U2.1 22.08,45.01 21.62,45.47 | 21.62,45.47 21.62,46.67 21.88,46.92 22.76,46.92 U2.3 | U1.3 26.35,41.21 | 26.35,41.21 25.1,41.21 24.6,40.71 | 24.6,40.71 v24.6,39.73 25.06,39.27 26.3,39.27 U1.1 | 24.6,40.71 24.6,40.88 21.62,43.86 21.62,45.47 | U3.1 29.41,44.56 27.66,44.56 | 26.35,41.21 26.35,43.35 27.56,44.56 27.66,44.56 | 27.66,44.56 27.66,48.23 28.79,49.36 C12.1 | v34.1,31.57 34.89,30.78 38.29,30.78 | v70.69,39.02 68.66,41.05 68.66,45.09 66.52,47.23 62.52,47.23 61.6,48.15 61.6,51.26 v61.68,51.34 | v30.62,57.23 30.62,55.78 30.91,55.49 31.72,55.49 31.75,55.52
  Bottom 0.406: 31.86,50.95 31.75,51.07 C5.1 31.75,55.52 31.75,55.58 C20.1 | 31.86,50.95 31.82,50.91 31.73,51.01 C12.1 | C11.1 31.86,50.95
R2IN
  Bottom 0.2: J5.4 50.48,44.14 51.17,43.45 53.83,43.45 56.74,46.36 66.27,46.36 67.48,45.14 U5.8
RST_LORA  (via drill 0.35)
  Top 0.2: MD1.11 v69.08,29.44
  Bottom 0.2: LORA-NICERF-V1.NRST 18.11,32.44 28.35,22.2 40.34,22.2 41.18,23.03 45.34,23.03 49.37,27.07 66.01,27.07 68.38,29.44 v69.08,29.44
RTS
  Bottom 0.2: Q1.2 67.44,12.67 66.55,11.78 61.42,11.78 60.35,12.86 57.76,12.86 56.93,13.68 R2.1 | R2.1 | R2.1 53,18.52 53,21.61 52.35,22.27 49.47,22.27 49.02,21.82 U$2.14
RX  (via drill 0.35)
  Top 0.2: D6.C 51.99,9.13 49.01,12.11 v49.01,13.56 49.01,14.25 49.64,14.88 51.85,14.88 52.53,15.56 52.53,19.38 51.35,20.56 MD1.35
  Bottom 0.2: v49.01,13.56 49.01,15.17 U$2.3
RX_DB9  (via drill 0.35)
  Top 0.2: v52.18,30.81 50.28,30.81 MD1.27
  Bottom 0.2: U5.9 68.6,36.57 70.64,34.52 70.64,32.82 69.57,31.75 67.84,31.75 64.99,28.9 54.09,28.9 v52.18,30.81
SCK_HSPI  (via drill 0.35)
  Top 0.2: v69.56,32.95 69.56,32.65 68.89,31.98 MD1.13
  Bottom 0.2: v69.56,32.95 68.03,32.95 64.98,29.9 60,29.9 53.78,36.11 20.75,36.11 19.96,36.91 19.96,44.81 18.65,46.11 U$3.SCLK
SCK_VSPI  (via drill 0.35)
  Top 0.2: v22.06,23.54 22.42,23.9 32.82,23.9 34.31,25.39 38.35,25.39 39.4,26.44 48.42,26.44 48.89,26.9 MD1.30
  Bottom 0.2: LORA-NICERF-V1.SCK 20.8,22.28 v22.06,23.54
SS_LAN_CONV  (via drill 0.35)
  Top 0.2: MD1.26 50.16,32 v48.67,32
  Bottom 0.2: U$3.CS 18.93,43.57 19.45,43.05 19.45,36.39 20.28,35.56 46.85,35.56 48.67,33.73 v48.67,32
SS_LORA  (via drill 0.35)
  Top 0.2: v20.57,26.08 20.61,26.12 37.83,26.12 40.33,28.61 48.8,28.61 49.24,28.17 MD1.29
  Bottom 0.2: LORA-NICERF-V1.NSS 20.57,26.09 v20.57,26.08
T2OUT
  Bottom 0.2: J5.5 49.21,43.88 50.64,42.44 53.91,42.44 57.19,45.72 65.51,45.72 66.21,45.03 U5.7
TX  (via drill 0.35)
  Top 0.2: D1.C 50.83,11.38 50.3,11.91 v50.3,13.67 | 50.3,13.38 v50.3,13.67 | MD1.34 50.92,21.82 53.05,19.69 53.05,15.28 51.44,13.67 v50.3,13.67
  Bottom 0.2: v50.3,13.67 v50.29,13.68 U$2.2
TX_DB9  (via drill 0.35)
  Top 0.2: v52.05,29.47 50.21,29.47 MD1.28
  Bottom 0.2: U5.10 66.21,38.46 66.96,39.21 68.98,39.21 69.78,38.41 69.78,36.19 71.15,34.81 71.15,32.62 69.71,31.18 68.05,31.18 65.16,28.28 53.24,28.28 v52.05,29.47
USB_N
  Bottom 0.2: U$2.6 45.21,14.02 45.65,13.59 45.65,9.08 45.25,8.68 45.25,6.25 45.89,5.61 J3.2
USB_P
  Bottom 0.2: U$2.5 46.48,14.02 46.05,13.59 46.05,12.41 arc90 46.4,12.05 47.09,12.05 arc-90 47.44,11.7 47.44,10.82 arc-90 47.09,10.47 46.4,10.47 arc90 46.05,10.12 46.05,9.08 48.09,7.04 J3.3
VCC  (via drill 0.35)
  Top 0.2: v46.15,4.48 46.15,6.47 J3.1 46.48,8.44 47.39,9.34 47.39,13.18 45.69,14.88 43.53,14.88 40.8,17.6 37.13,17.6 v36.25,18.48 35.7,19.03 35.7,22.98 35.4,23.28 v34.78,23.28 41.34,23.28 v42.05,23.99 | C25.+ 73.95,54.36 v73.95,51.32
  Bottom 0.2: v46.15,4.48 47.35,3.27 50.02,3.27 50.81,4.06 52.54,4.06 53.86,2.74 53.86,1.83 54.58,1.12 57.29,1.12 57.93,1.76 57.93,6.2 58.62,6.89 63.71,6.89 R4.2 64.98,7.76 66.86,9.64 R5.2 | D5.A 35.37,24.02 34.78,23.43 v34.78,23.28 | C1.1 42.01,24.03 v42.05,23.99 42.42,23.62 45.25,23.62 49.32,27.69 65.52,27.69 68.5,30.66 70.12,30.66 75.22,35.76 75.22,37.88 74.03,39.07 72.07,39.07 69.64,41.5 69.64,49.04 70.66,50.07 72.73,50.07 73.95,51.29 v73.95,51.32 | U$2.16 51.56,18.92 50.61,17.96 36.76,17.96 v36.25,18.48